# EAGLE design ponte_ampli_V1.6 (EAGLE 4.09)
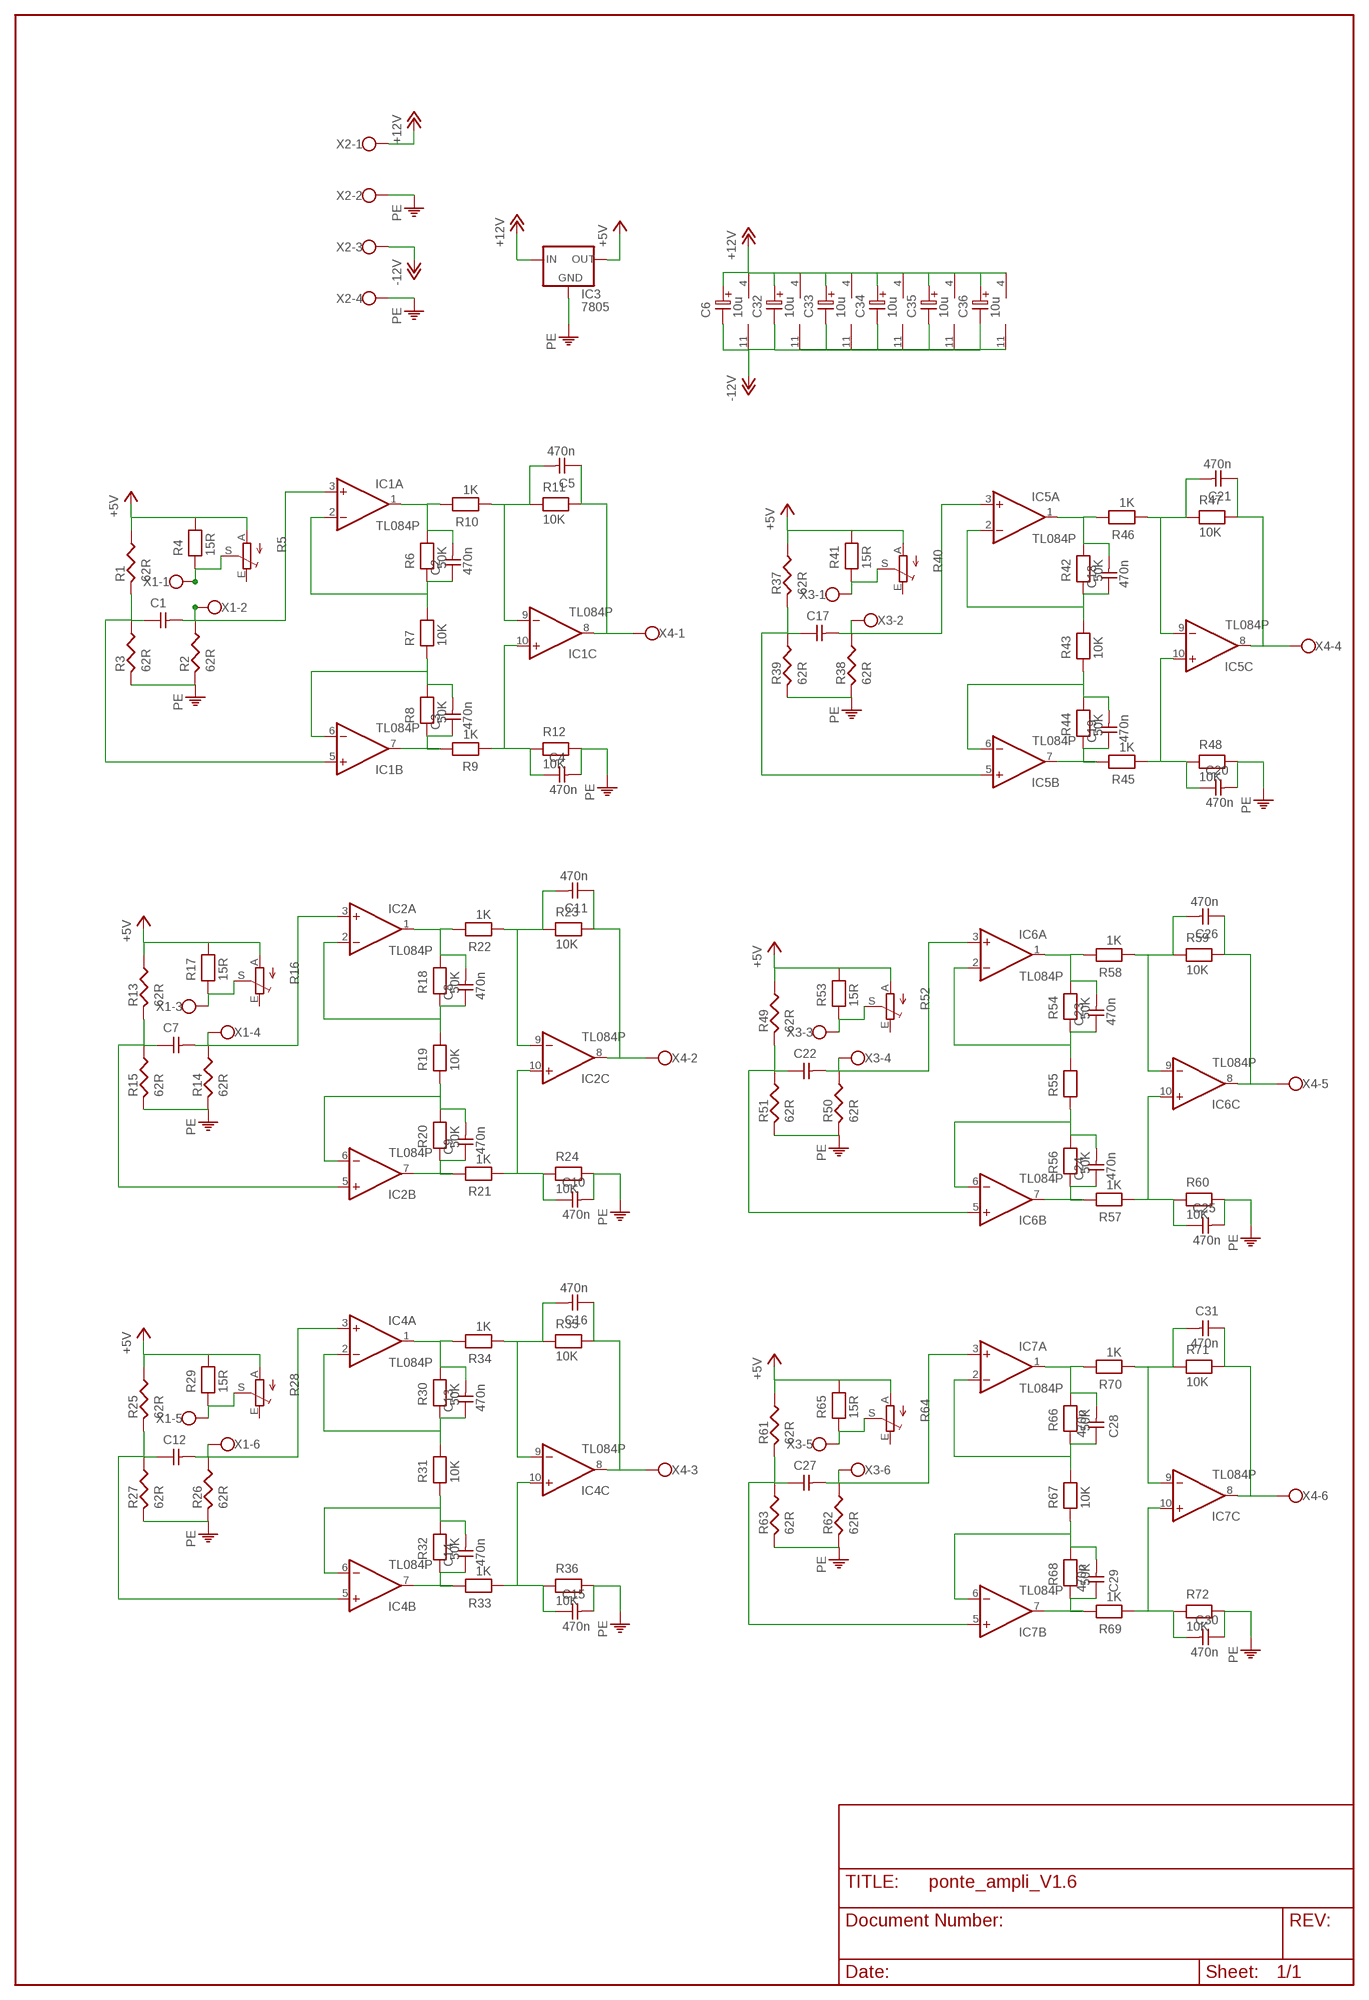
[diagram p0: schematic, sheet 1]

## Parts
C1  CAPNP-5  [C-5]
C2  470n  CAPNP-5  [C-5]
C3  470n  CAPNP-5  [C-5]
C4  470n  CAPNP-5  [C-5]
C5  470n  CAPNP-5  [C-5]
C6  10u  ELC-2,5L  [ES-2,5L]
C7  CAPNP-5  [C-5]
C8  470n  CAPNP-5  [C-5]
C9  470n  CAPNP-5  [C-5]
C10  470n  CAPNP-5  [C-5]
C11  470n  CAPNP-5  [C-5]
C12  CAPNP-5  [C-5]
C13  470n  CAPNP-5  [C-5]
C14  470n  CAPNP-5  [C-5]
C15  470n  CAPNP-5  [C-5]
C16  470n  CAPNP-5  [C-5]
C17  CAPNP-5  [C-5]
C18  470n  CAPNP-5  [C-5]
C19  470n  CAPNP-5  [C-5]
C20  470n  CAPNP-5  [C-5]
C21  470n  CAPNP-5  [C-5]
C22  CAPNP-5  [C-5]
C23  470n  CAPNP-5  [C-5]
C24  470n  CAPNP-5  [C-5]
C25  470n  CAPNP-5  [C-5]
C26  470n  CAPNP-5  [C-5]
C27  CAPNP-5  [C-5]
C28  470n  CAPNP-5  [C-5]
C29  470n  CAPNP-5  [C-5]
C30  470n  CAPNP-5  [C-5]
C31  470n  CAPNP-5  [C-5]
C32  10u  ELC-2,5L  [ES-2,5L]
C33  10u  ELC-2,5L  [ES-2,5L]
C34  10u  ELC-2,5L  [ES-2,5L]
C35  10u  ELC-2,5L  [ES-2,5L]
C36  10u  ELC-2,5L  [ES-2,5L]
IC1  TL084P  [DIL14]
IC2  TL084P  [DIL14]
IC3  7805  78XXL  [78XXL]
IC4  TL084P  [DIL14]
IC5  TL084P  [DIL14]
IC6  TL084P  [DIL14]
IC7  TL084P  [DIL14]
R1  62R  RESUS-7,5  [R-7,5]
R2  62R  RESUS-7,5  [R-7,5]
R3  62R  RESUS-7,5  [R-7,5]
R4  15R  RESEU-7,5  [R-7,5]
R5  TRIM_EU-S64W  [S64W]
R6  50K  RESEU-7,5  [R-7,5]
R7  10K  RESEU-7,5  [R-7,5]
R8  50K  RESEU-7,5  [R-7,5]
R9  1K  RESEU-7,5  [R-7,5]
R10  1K  RESEU-7,5  [R-7,5]
R11  10K  RESEU-7,5  [R-7,5]
R12  10K  RESEU-7,5  [R-7,5]
R13  62R  RESUS-7,5  [R-7,5]
R14  62R  RESUS-7,5  [R-7,5]
R15  62R  RESUS-7,5  [R-7,5]
R16  TRIM_EU-S64W  [S64W]
R17  15R  RESEU-7,5  [R-7,5]
R18  50K  RESEU-7,5  [R-7,5]
R19  10K  RESEU-7,5  [R-7,5]
R20  50K  RESEU-7,5  [R-7,5]
R21  1K  RESEU-7,5  [R-7,5]
R22  1K  RESEU-7,5  [R-7,5]
R23  10K  RESEU-7,5  [R-7,5]
R24  10K  RESEU-7,5  [R-7,5]
R25  62R  RESUS-7,5  [R-7,5]
R26  62R  RESUS-7,5  [R-7,5]
R27  62R  RESUS-7,5  [R-7,5]
R28  TRIM_EU-S64W  [S64W]
R29  15R  RESEU-7,5  [R-7,5]
R30  50K  RESEU-7,5  [R-7,5]
R31  10K  RESEU-7,5  [R-7,5]
R32  50K  RESEU-7,5  [R-7,5]
R33  1K  RESEU-7,5  [R-7,5]
R34  1K  RESEU-7,5  [R-7,5]
R35  10K  RESEU-7,5  [R-7,5]
R36  10K  RESEU-7,5  [R-7,5]
R37  62R  RESUS-7,5  [R-7,5]
R38  62R  RESUS-7,5  [R-7,5]
R39  62R  RESUS-7,5  [R-7,5]
R40  TRIM_EU-S64W  [S64W]
R41  15R  RESEU-7,5  [R-7,5]
R42  50K  RESEU-7,5  [R-7,5]
R43  10K  RESEU-7,5  [R-7,5]
R44  50K  RESEU-7,5  [R-7,5]
R45  1K  RESEU-7,5  [R-7,5]
R46  1K  RESEU-7,5  [R-7,5]
R47  10K  RESEU-7,5  [R-7,5]
R48  10K  RESEU-7,5  [R-7,5]
R49  62R  RESUS-7,5  [R-7,5]
R50  62R  RESUS-7,5  [R-7,5]
R51  62R  RESUS-7,5  [R-7,5]
R52  TRIM_EU-S64W  [S64W]
R53  15R  RESEU-7,5  [R-7,5]
R54  50K  RESEU-7,5  [R-7,5]
R55  RESEU-7,5  [R-7,5]
R56  50K  RESEU-7,5  [R-7,5]
R57  1K  RESEU-7,5  [R-7,5]
R58  1K  RESEU-7,5  [R-7,5]
R59  10K  RESEU-7,5  [R-7,5]
R60  10K  RESEU-7,5  [R-7,5]
R61  62R  RESUS-7,5  [R-7,5]
R62  62R  RESUS-7,5  [R-7,5]
R63  62R  RESUS-7,5  [R-7,5]
R64  TRIM_EU-S64W  [S64W]
R65  15R  RESEU-7,5  [R-7,5]
R66  50K  RESEU-7,5  [R-7,5]
R67  10K  RESEU-7,5  [R-7,5]
R68  50K  RESEU-7,5  [R-7,5]
R69  1K  RESEU-7,5  [R-7,5]
R70  1K  RESEU-7,5  [R-7,5]
R71  10K  RESEU-7,5  [R-7,5]
R72  10K  RESEU-7,5  [R-7,5]
X1  AK500/6  [AK500/6]
X2  AK500/4  [AK500/4]
X3  AK500/6  [AK500/6]
X4  AK500/6  [AK500/6]

## Nets
+5V: IC3.OUT R1.1 R4.2 R5.A R13.1 R16.A R17.2 R25.1 R28.A R29.2 R37.1 R40.A R41.2 R49.1 R52.A R53.2 R61.1 R64.A R65.2
+12V: C6.1 C32.1 C33.1 C34.1 C35.1 C36.1 IC1.4(P:V+) IC2.4(P:V+) IC3.IN IC4.4(P:V+) IC5.4(P:V+) IC6.4(P:V+) IC7.4(P:V+) X2.1
-12V: C6.2 C32.2 C33.2 C34.2 C35.2 C36.2 IC1.11(P:V-) IC2.11(P:V-) IC4.11(P:V-) IC5.11(P:V-) IC6.11(P:V-) IC7.11(P:V-) X2.3
N$1: C1.1 IC1.5(B:+IN) R1.2 R3.1
N$2: C1.2 IC1.3(A:+IN) R2.1 X1.2
N$3: C5.2 IC1.9(C:-IN) R10.1 R11.1
N$4: C2.2 IC1.1(A:OUT) R6.2 R10.2
N$5: R4.1 R5.S X1.1
N$6: C4.1 IC1.10(C:+IN) R9.1 R12.1
N$7: C2.1 IC1.2(A:-IN) R6.1 R7.2
N$8: C11.1 IC2.8(C:OUT) R23.2 X4.2
N$9: C3.1 IC1.7(B:OUT) R8.1 R9.2
N$10: C7.1 IC2.5(B:+IN) R13.2 R15.1
N$11: C7.2 IC2.3(A:+IN) R14.1 X1.4
N$12: R16.S R17.1 X1.3
N$13: C8.2 IC2.1(A:OUT) R18.2 R22.2
N$14: C8.1 IC2.2(A:-IN) R18.1 R19.2
N$15: C3.2 IC1.6(B:-IN) R7.1 R8.2
N$16: C9.1 IC2.7(B:OUT) R20.1 R21.2
N$17: C11.2 IC2.9(C:-IN) R22.1 R23.1
N$18: C10.1 IC2.10(C:+IN) R21.1 R24.1
N$19: C9.2 IC2.6(B:-IN) R19.1 R20.2
N$20: C12.1 IC4.5(B:+IN) R25.2 R27.1
N$21: C12.2 IC4.3(A:+IN) R26.1 X1.6
N$22: R28.S R29.1 X1.5
N$23: C13.2 IC4.1(A:OUT) R30.2 R34.2
N$24: C13.1 IC4.2(A:-IN) R30.1 R31.2
N$25: C14.1 IC4.7(B:OUT) R32.1 R33.2
N$26: C16.2 IC4.9(C:-IN) R34.1 R35.1
N$27: C15.1 IC4.10(C:+IN) R33.1 R36.1
N$28: C14.2 IC4.6(B:-IN) R31.1 R32.2
N$29: C17.1 IC5.5(B:+IN) R37.2 R39.1
N$30: C17.2 IC5.3(A:+IN) R38.1 X3.2
N$31: R40.S R41.1 X3.1
N$32: C18.2 IC5.1(A:OUT) R42.2 R46.2
N$33: C18.1 IC5.2(A:-IN) R42.1 R43.2
N$34: C19.1 IC5.7(B:OUT) R44.1 R45.2
N$35: C21.2 IC5.9(C:-IN) R46.1 R47.1
N$36: C20.1 IC5.10(C:+IN) R45.1 R48.1
N$37: C19.2 IC5.6(B:-IN) R43.1 R44.2
N$38: C22.1 IC6.5(B:+IN) R49.2 R51.1
N$39: C22.2 IC6.3(A:+IN) R50.1 X3.4
N$40: R52.S R53.1 X3.3
N$41: C23.2 IC6.1(A:OUT) R54.2 R58.2
N$42: C23.1 IC6.2(A:-IN) R54.1 R55.2
N$43: C24.1 IC6.7(B:OUT) R56.1 R57.2
N$44: C26.2 IC6.9(C:-IN) R58.1 R59.1
N$45: C25.1 IC6.10(C:+IN) R57.1 R60.1
N$46: C24.2 IC6.6(B:-IN) R55.1 R56.2
N$47: C27.1 IC7.5(B:+IN) R61.2 R63.1
N$48: C27.2 IC7.3(A:+IN) R62.1 X3.6
N$49: R64.S R65.1 X3.5
N$50: C28.2 IC7.1(A:OUT) R66.2 R70.2
N$51: C28.1 IC7.2(A:-IN) R66.1 R67.2
N$52: C29.1 IC7.7(B:OUT) R68.1 R69.2
N$53: C31.2 IC7.9(C:-IN) R70.1 R71.1
N$54: C30.2 IC7.10(C:+IN) R69.1 R72.1
N$55: C29.2 IC7.6(B:-IN) R67.1 R68.2
N$56: C16.1 IC4.8(C:OUT) R35.2 X4.3
N$57: C5.1 IC1.8(C:OUT) R11.2 X4.1
N$58: C31.1 IC7.8(C:OUT) R71.2 X4.6
N$59: C26.1 IC6.8(C:OUT) R59.2 X4.5
N$60: C21.1 IC5.8(C:OUT) R47.2 X4.4
PE: C4.2 C10.2 C15.2 C20.2 C25.2 C30.1 IC3.GND R2.2 R3.2 R12.2 R14.2 R15.2 R24.2 R26.2 R27.2 R36.2 R38.2 R39.2 R48.2 R50.2 R51.2 R60.2 R62.2 R63.2 R72.2 X2.2 X2.4
Unconnected: IC1.12(D:+IN) IC1.13(D:-IN) IC1.14(D:OUT) IC2.12(D:+IN) IC2.13(D:-IN) IC2.14(D:OUT) IC4.12(D:+IN) IC4.13(D:-IN) IC4.14(D:OUT) IC5.12(D:+IN) IC5.13(D:-IN) IC5.14(D:OUT) IC6.12(D:+IN) IC6.13(D:-IN) IC6.14(D:OUT) IC7.12(D:+IN) IC7.13(D:-IN) IC7.14(D:OUT) R5.E R16.E R28.E R40.E R52.E R64.E

## Library data of the parts
C1-C5 C7-C31 = discrete:CAPNP-5
C6 C32-C36 = discrete:ELC-2,5L
IC1 IC2 IC4-IC7 = linear:TL084: OP AMP
IC3 = v-reg:78XXL: VOLTAGE REGULATOR
R1-R3 R13-R15 R25-R27 R37-R39 R49-R51 R61-R63 = discrete:RESUS-7,5
R4 R6-R12 R17-R24 R29-R36 R41-R48 R53-R60 R65-R72 = discrete:RESEU-7,5
R5 R16 R28 R40 R52 R64 = pot:TRIM_EU-: POTENTIOMETER
X1 X3 X4 = con-ptr500:AK500/6: CONNECTOR
X2 = con-ptr500:AK500/4: CONNECTOR

## Board
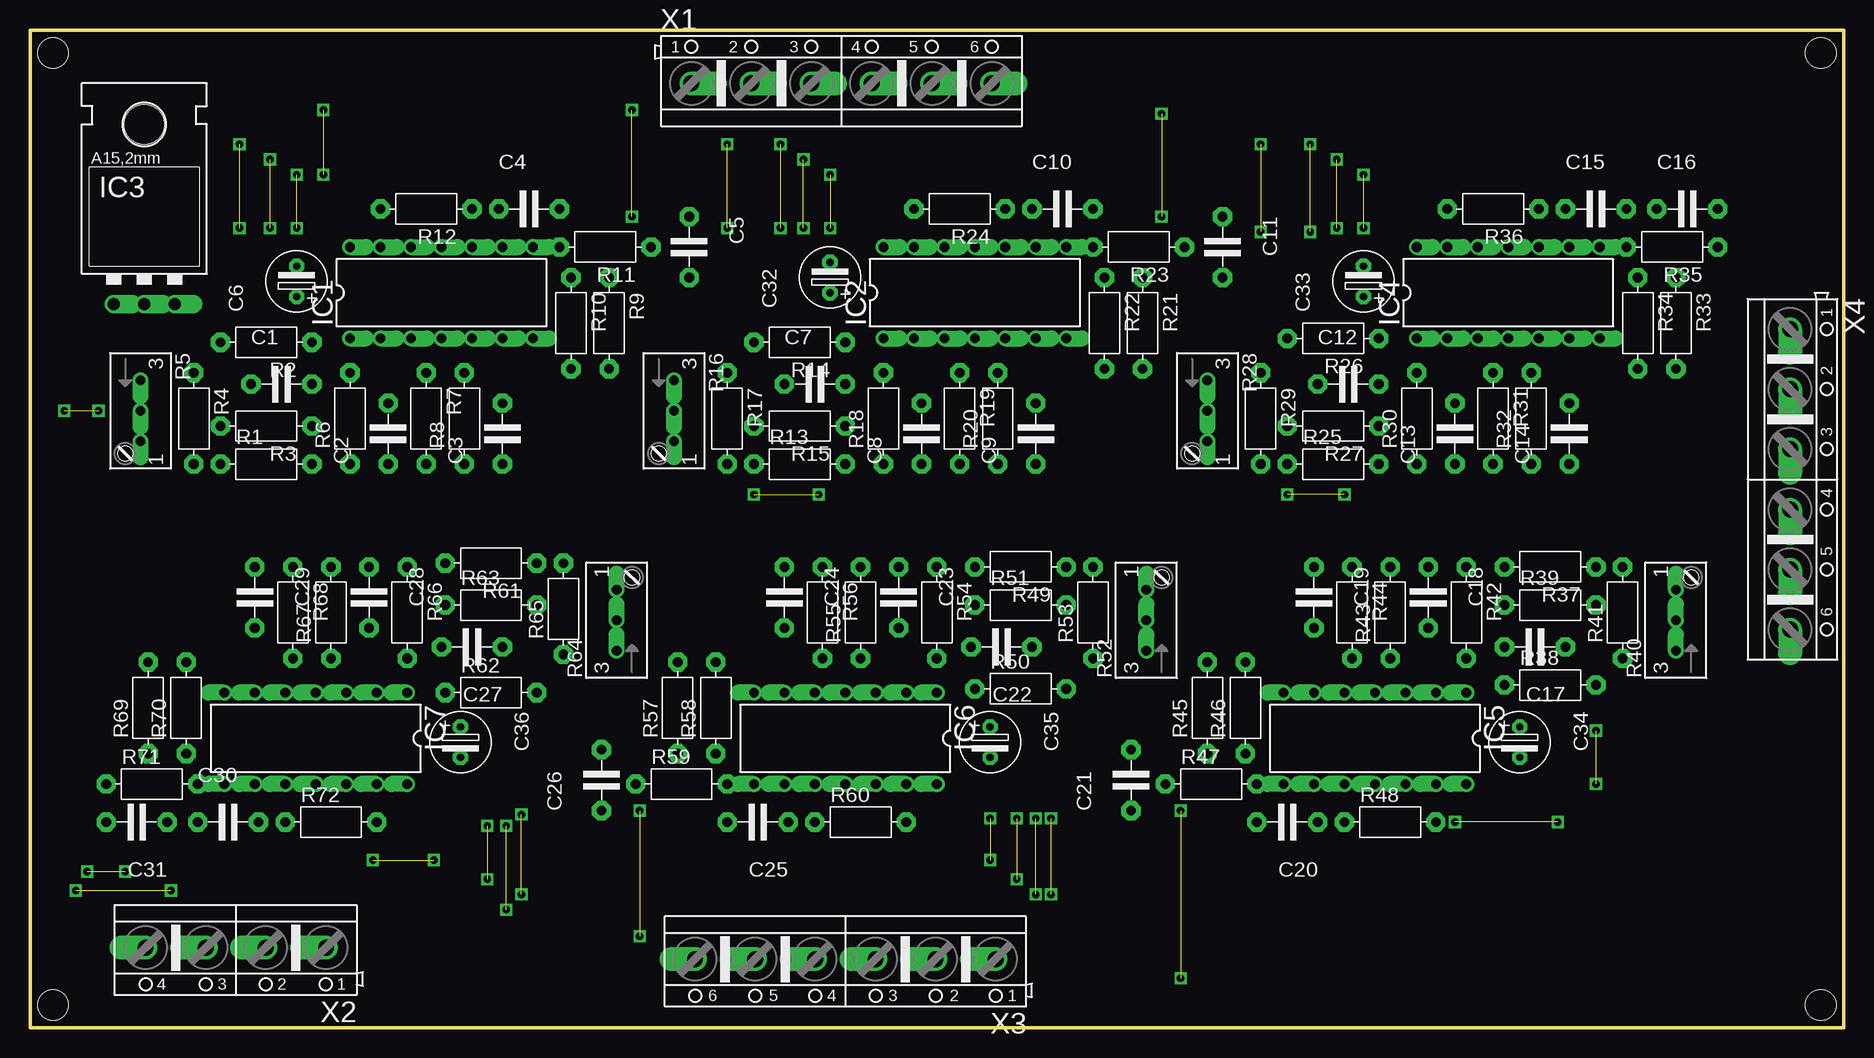
[diagram p1: board, top side]
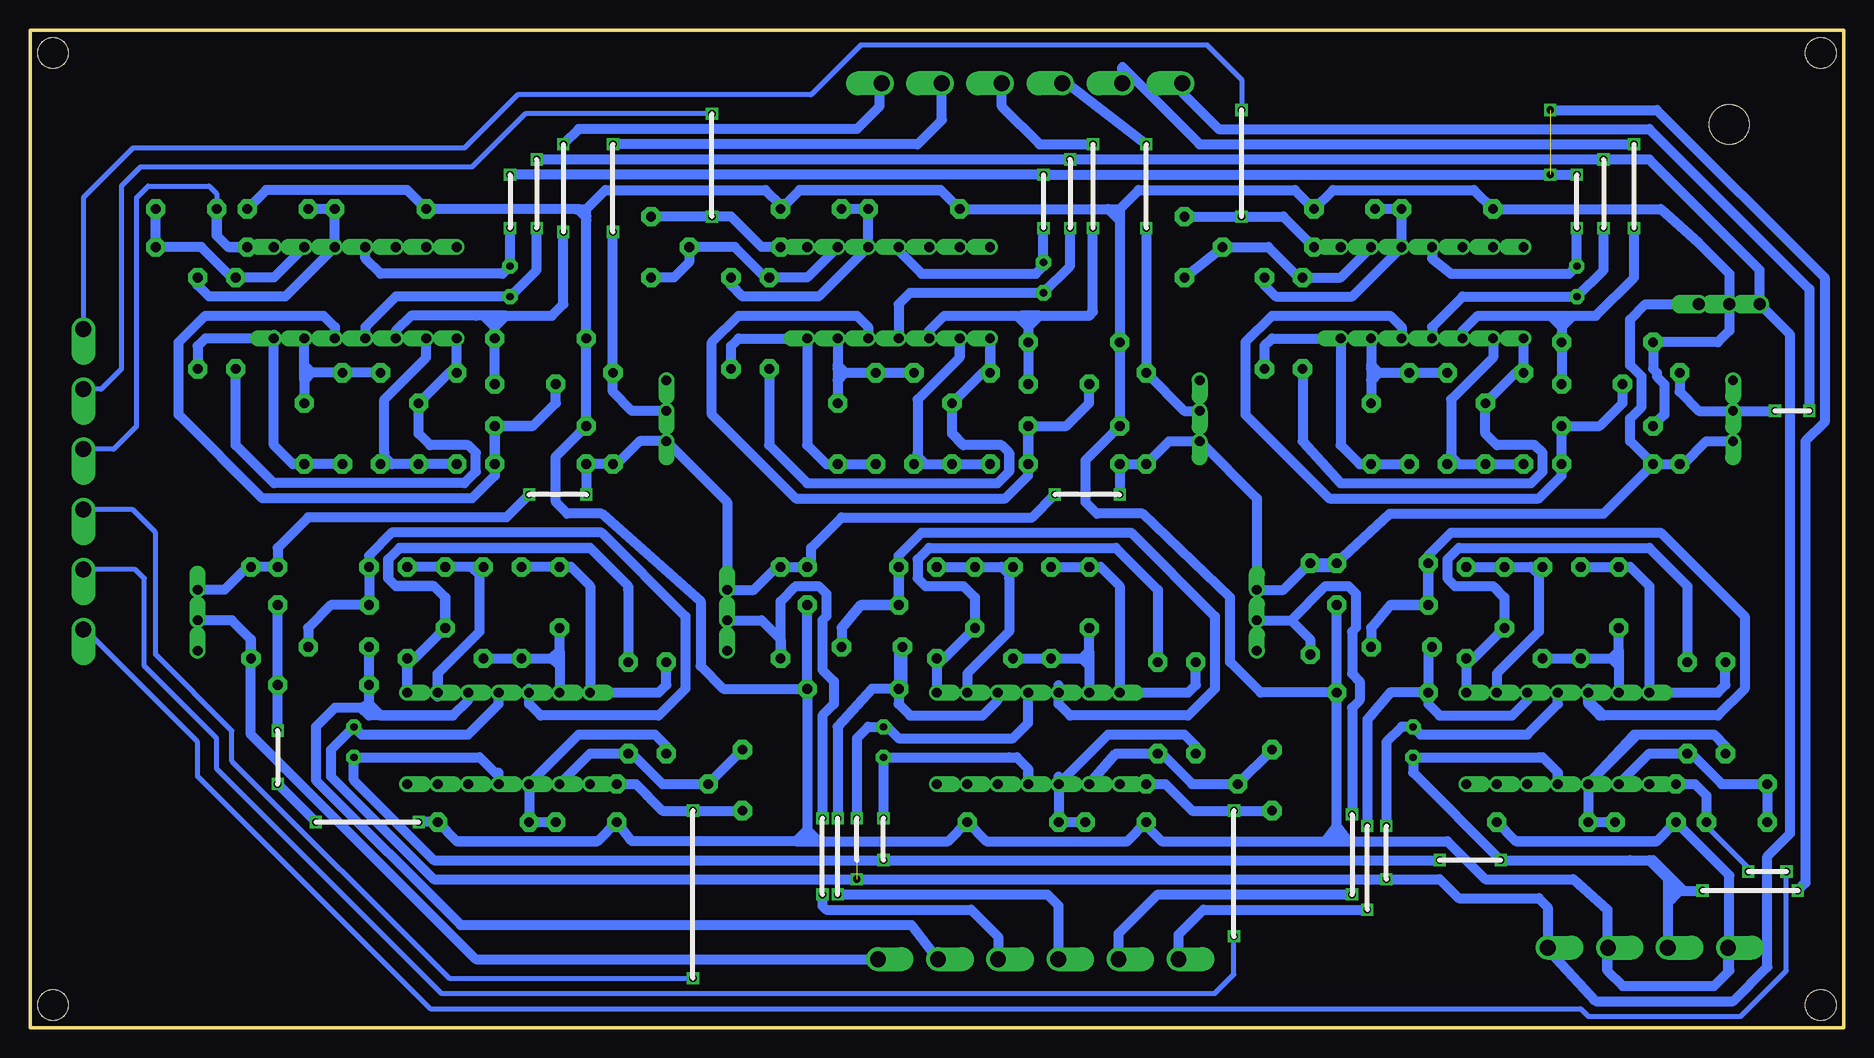
[diagram p2: board, bottom side, seen from below]

Size 151.13 x 83.19 mm. Coordinates in mm from the lower left corner, seen from the top.
Outline: 151.13,30.8 151.13,0 0,0 0,83.19 151.13,83.19 151.13,30.8
Outline: 151.13,30.8 151.13,33.34
Copper layers used: Bottom
Holes 2.54 mm at 1.9,81.28 149.22,81.28 149.22,1.91 1.9,1.91

### Footprints (pad centres in the part's own frame; a part is rotated, then mirrored left to right if it is on the bottom)
C-5 = drill 0.813 pad 1.6 octagon: 1 -2.54,0; 2 2.54,0
ES-2,5L = drill 0.61 pad 1.27 octagon: 1 0,0; 2 2.54,0
DIL14 = drill 0.813 offset: 1 -7.62,-3.81; 2 -5.08,-3.81; 3 -2.54,-3.81; 4 0,-3.81; 5 2.54,-3.81; 6 5.08,-3.81; 7 7.62,-3.81; 8 7.62,3.81; 9 5.08,3.81; 10 2.54,3.81; 11 0,3.81; 12 -2.54,3.81; 13 -5.08,3.81; 14 -7.62,3.81
78XXL = drill 1.016 offset: GND 0,-3.81; IN -2.54,-3.81; OUT 2.54,-3.81 | hole 3.302: 0,11.176
R-7,5 = drill 0.813 pad 1.6 octagon: 1 -3.81,0; 2 3.81,0
S64W = drill 0.813 offset: A 2.54,1.27; E -2.54,1.27; S 0,1.27
AK500/6 = drill 1.321 offset: 1 -12.522,0; 2 -7.518,0; 3 -2.515,0; 4 2.515,0; 5 7.518,0; 6 12.522,0
AK500/4 = drill 1.321 offset: 1 -7.518,0; 2 -2.489,0; 3 2.489,0; 4 7.518,0

### Placement (x,y rotation side)
C1  20.95,53.66 0 top
C2  29.84,49.53 90 top
C3  39.37,49.53 90 top
C4  41.59,68.26 0 top
C5  54.93,65.09 270 top
C6  22.22,60.96 90 top
C7  65.41,53.66 0 top
C8  74.3,49.53 90 top
C9  83.82,49.53 90 top
C10  86.04,68.26 0 top
C11  99.38,65.09 270 top
C12  109.85,53.66 0 top
C13  118.75,49.53 90 top
C14  128.27,49.53 90 top
C15  130.49,68.26 0 top
C16  138.11,68.26 0 top
C17  125.41,31.75 180 top
C18  116.52,35.88 270 top
C19  107,35.88 270 top
C20  104.78,17.14 180 top
C21  91.76,20.64 90 top
C22  80.96,31.75 180 top
C23  72.39,35.88 270 top
C24  62.86,35.88 270 top
C25  60.64,17.14 180 top
C26  47.62,20.64 90 top
C27  36.83,31.75 180 top
C28  28.26,35.88 270 top
C29  18.73,35.88 270 top
C30  16.51,17.14 0 top
C31  8.89,17.14 180 top
C32  66.67,61.28 90 top
C33  111.12,60.96 90 top
C34  124.14,25.08 270 top
C35  80.01,25.08 270 top
C36  35.88,25.08 270 top
IC1  34.29,61.28 0 top
IC2  78.74,61.28 0 top
IC3  9.52,64.13 0 top
IC4  123.19,61.28 0 top
IC5  112.08,24.13 180 top
IC6  67.94,24.13 180 top
IC7  23.81,24.13 180 top
R1  19.68,46.99 0 top
R2  19.68,57.15 180 top
R3  19.68,50.16 180 top
R4  13.65,50.8 270 top
R5  7.94,51.43 270 top
R6  26.67,50.8 90 top
R7  33.02,50.8 270 top
R8  36.19,50.8 90 top
R9  48.26,58.74 270 top
R10  45.08,58.74 270 top
R11  47.94,65.09 180 top
R12  33.02,68.26 180 top
R13  64.13,46.99 0 top
R14  64.13,57.15 180 top
R15  64.13,50.16 180 top
R16  52.39,51.43 270 top
R17  58.1,50.8 270 top
R18  71.12,50.8 90 top
R19  77.47,50.8 270 top
R20  80.64,50.8 90 top
R21  92.71,58.74 270 top
R22  89.53,58.74 270 top
R23  92.39,65.09 180 top
R24  77.47,68.26 180 top
R25  108.58,46.99 0 top
R26  108.58,57.47 180 top
R27  108.58,50.16 180 top
R28  96.84,51.43 270 top
R29  102.55,50.8 270 top
R30  115.57,50.8 90 top
R31  121.92,50.8 270 top
R32  125.09,50.8 90 top
R33  137.16,58.74 270 top
R34  133.99,58.74 270 top
R35  136.84,65.09 180 top
R36  121.92,68.26 180 top
R37  126.68,38.42 180 top
R38  126.68,28.57 0 top
R39  126.68,35.24 0 top
R40  138.43,33.97 90 top
R41  132.72,34.61 90 top
R42  119.7,34.61 270 top
R43  113.35,34.61 90 top
R44  110.17,34.61 270 top
R45  98.11,26.67 90 top
R46  101.28,26.67 90 top
R47  98.42,20.32 0 top
R48  113.35,17.14 0 top
R49  82.55,38.42 180 top
R50  82.55,28.26 0 top
R51  82.55,35.24 0 top
R52  94.3,33.97 90 top
R53  88.58,34.61 90 top
R54  75.56,34.61 270 top
R55  69.22,34.61 90 top
R56  66.04,34.61 270 top
R57  53.97,26.67 90 top
R58  57.15,26.67 90 top
R59  54.29,20.32 0 top
R60  69.22,17.14 0 top
R61  38.42,38.73 180 top
R62  38.42,27.94 0 top
R63  38.42,35.24 0 top
R64  50.16,33.97 90 top
R65  44.45,34.92 90 top
R66  31.43,34.61 270 top
R67  25.08,34.61 90 top
R68  21.91,34.61 270 top
R69  9.84,26.67 90 top
R70  13.02,26.67 90 top
R71  10.16,20.32 0 top
R72  25.08,17.14 0 top
X1  67.63,78.74 0 top
X2  17.14,6.67 180 top
X3  67.94,5.71 180 top
X4  146.69,45.72 270 top

### Tracks (layer width: path | path; a pad name or v marks a point on that pad's centre or on a via)
+5V  (via drill 0.61)  (2 unrouted)
  Bottom 0.406: 102.24,46.99 R29.2
  Bottom 0.813: R1.1 R4.2 13.33,46.99 11.43,48.89 R5.A | 102.24,46.99 100.33,48.89 R28.A 93.03,43.81 R52.A 90.8,36.51 88.9,38.42 R53.2 R49.1 86.04,38.42 86.04,40 83.5,42.54 67.63,42.54 v65.72,44.45 | R29.2 R25.1 v104.78,44.45 | R40.A 134.94,36.51 133.03,38.42 R41.2 R37.1 130.49,40 127.95,42.54 111.44,42.54 v109.54,44.45 | IC3.OUT 16.51,60.32 17.78,59.05 17.78,55.24 16.83,54.29 16.83,51.75 17.78,50.8 17.78,48.89 R1.1 | R1.1 20,42.86 37.78,42.86 R61.1 R65.2 46.67,36.51 R64.A 48.89,44.13 R16.A 56.2,48.89 R17.2 R13.1 v60.33,44.45
+5V1
  Bottom 0.813: 53.66,48.89 56.2,48.89 58.1,46.99 60.33,46.99
+5V2
  Bottom 0.813: 104.78,46.99 102.24,46.99 100.33,48.89 98.11,48.89
+5V3
  Bottom 0.813: 130.49,38.42 133.03,38.42 134.94,36.51 137.16,36.51
+5V4
  Bottom 0.813: 86.36,38.42 88.9,38.42 90.8,36.51 93.03,36.51
+5V5
  Bottom 0.813: 42.23,38.42 44.77,38.42 46.67,36.51 48.89,36.51
+12V  (via drill 0.61)  (5 unrouted)
  Bottom 0.406: 81.28,25.08 79.69,25.08
  Bottom 0.813: IC1.4 34.29,58.42 31.75,60.96 C6.1 20,63.18 20,66.67 | IC2.4 78.74,60.32 77.79,61.28 C32.1 64.45,63.5 64.45,66.67 | IC4.4 123.19,58.42 120.65,60.96 C33.1 108.9,63.18 v108.9,66.67 | v108.9,72.39 v64.45,72.39 v20,72.39 16.19,72.39 6.99,63.18 IC3.IN 4.44,57.78 4.44,16.19 6.35,14.29 6.35,5.08 9.21,2.22 20.64,2.22 24.45,6.35 X2.1 24.66,10.06 25.4,10.8 32.07,10.8 33.65,12.38 v38.1,12.38 v82.23,12.38 117.47,12.38 126.05,20.95 126.05,23.18 C34.1 123.51,24.45 114.62,24.45 112.08,26.99 IC5.4 | IC7.4 23.81,26.99 26.35,24.45 35.24,24.45 C36.1 36.83,25.08 38.1,23.81 v38.1,16.83 | 79.69,25.08 C35.1 80.33,25.08 | 79.69,25.08 78.74,24.13 69.22,24.13 67.95,25.4 IC6.4 | v82.23,17.46 82.23,24.13 81.28,25.08 80.33,25.08 | 80.33,25.08 79.69,25.08
+12V2
  Bottom 0.813: 123.19,57.47 123.19,58.42 120.65,60.96 111.76,60.96
+12V3
  Bottom 0.813: 112.08,27.94 112.08,26.99 114.62,24.45 123.51,24.45 124.14,25.08
-12V  (via drill 0.61)  (7 unrouted)
  Bottom 0.813: IC1.11 34.29,64.13 32.7,62.86 22.86,62.86 C6.2 v22.22,66.67 | IC2.11 78.74,64.77 76.84,62.86 67.31,62.86 66.68,63.5 C32.2 v66.68,66.67 | IC4.11 123.19,64.13 121.92,62.86 111.76,62.86 C33.2 111.13,66.67 | IC7.11 23.81,21.27 25.08,22.54 C36.2 35.88,21.27 v28.57,13.97 17.78,13.97 | IC5.11 112.08,20.95 113.67,22.54 C34.2 124.14,20.64 117.47,13.97 v80.01,13.97 v33.65,13.97 | IC6.11 67.95,21.59 68.9,22.54 C35.2 v80.01,17.46 | 14.66,12.43 X2.3 | 16.19,13.97 14.66,12.43 | v111.13,71.12 v66.68,71.12 v24.45,71.12 v22.22,71.12 | v3.81,11.43 3.18,12.06 3.18,48.89 1.59,50.48 1.59,62.55 15.56,76.52 v24.45,76.52 | 14.66,12.43 14.61,12.43 14.61,12.38 | 14.61,12.38 14.61,11.11 13.97,11.75 14.61,12.38 | 16.19,13.97 14.61,12.38 | 17.78,13.97 16.19,13.97 | 17.78,13.97 15.88,13.97 13.65,11.75 | 13.65,11.75 13.97,11.43 | 14.61,10.8 14.29,10.8 | 14.29,10.8 13.65,11.43 | 14.29,10.8 14.61,10.48 14.61,10.8 | 13.97,11.43 14.61,10.8 | 13.97,11.43 13.33,11.43 | 13.33,11.43 v11.75,11.43 | 13.65,11.75 13.33,11.43
-12V2  (via drill 0.61)
  other vias: 111.12,66.67
-12V3
  Bottom 0.813: 124.14,22.54 113.67,22.54
-12V4
  Bottom 0.813: 80.01,22.54 69.53,22.54
-12V5
  Bottom 0.813: 35.88,22.54 25.4,22.54
N$1
  Bottom 0.813: IC1.5 36.83,58.42 37.78,59.37 47.62,59.37 49.85,57.15 49.85,51.12 42.86,44.13 25.4,44.13 23.5,46.04 R1.2 R3.1 20.32,50.16 18.42,52.07 C1.1
N$2  (via drill 0.61)  (1 unrouted)
  Bottom 0.813: C1.2 R2.1 23.5,58.42 | IC1.3 31.75,58.1 30.48,59.37 | 30.48,59.37 24.45,59.37 23.5,58.42 | 30.48,59.37 22.54,59.37 | 22.54,59.37 22.22,59.37 | 22.54,59.37 23.5,58.42 | 22.54,59.37 20.64,59.37 17.46,62.55 v17.46,66.67 | X1.2 60.11,80.11 53.66,73.66 v17.46,73.66
N$3
  Bottom 0.813: C5.2 R11.1 47.94,65.09 45.4,62.55 R10.1 41.91,62.55 IC1.9
N$4
  Bottom 0.813: R6.2 26.67,54.29 | R6.2 IC1.1 | R6.2 27.31,54.61 C2.2 29.85,49.53 28.89,48.58 25.72,48.58 25.08,47.94 25.08,46.35 26.03,45.4 41.91,45.4 45.09,48.89 R10.2
N$5  (via drill 0.61)  (1 unrouted)
  Bottom 0.813: 12.07,51.43 R5.S | R4.1 13.65,53.02 12.07,51.43 | 12.07,51.43 v5.71,51.43 | v2.86,51.43 2.86,61.59 16.19,74.93 52.07,74.93 55.11,77.96 X1.1
N$6
  Bottom 0.813: C4.1 R12.1 IC1.10 40.96,60.96 47.31,60.96 48.26,61.91 R9.1
N$7
  Bottom 0.813: R6.1 C2.1 32.07,46.99 | IC1.2 29.21,55.88 32.7,52.39 32.7,47.94 | 32.7,47.94 32.7,47.31 R7.2 32.07,46.99 | 32.7,47.94 32.7,47.62 32.07,46.99
N$8  (via drill 0.61)  (1 unrouted)
  Bottom 0.406: v94.3,76.2 109.86,76.2 114.3,71.75 141.92,71.75 143.51,70.17 143.51,54.93 145.2,53.24 X4.2
  Bottom 0.813: R23.2 IC2.8 R23.2 | R23.2 90.17,65.09 92.71,67.63 v94.3,67.63 C11.1
N$9
  Bottom 0.813: R8.1 C3.1 40.32,46.99 41.91,48.58 IC1.7 47.62,57.47 48.26,56.83 R9.2
N$10
  Bottom 0.813: R15.1 R13.2 | R15.1 64.77,50.16 62.87,52.07 C7.1 | R15.1 67.95,46.04 69.85,44.13 87.31,44.13 94.3,51.12 94.3,57.15 92.07,59.37 82.23,59.37 81.28,58.42 IC2.5
N$11  (via drill 0.61)  (1 unrouted)
  Bottom 0.813: C7.2 R14.1 67.95,58.42 | 67.95,58.42 68.9,59.37 74.93,59.37 76.2,58.1 IC2.3 | 67.95,58.42 67.95,59.05 67.63,59.37 | 67.63,59.37 68.58,59.37 | 66.99,59.37 67.63,59.37 | 67.95,58.42 66.99,59.37 | 66.99,59.37 62.87,59.37 62.55,59.69 v62.55,66.67 | X1.4 70.14,76.81 66.99,73.66 v62.55,73.66
N$12  (via drill 0.61)  (1 unrouted)
  Bottom 0.813: R16.S 54.93,51.43 R17.1 v58.1,66.67 | X1.3 65.09,79.06 v58.1,73.66
N$13
  Bottom 0.813: IC2.1 R18.2 71.75,54.61 C8.2 74.29,49.53 73.34,48.58 70.17,48.58 69.53,47.94 69.53,46.35 70.49,45.4 86.36,45.4 89.53,48.58 R22.2
N$14
  Bottom 0.813: R18.1 C8.1 76.52,46.99 | 76.52,46.99 77.15,47.62 77.15,52.39 73.66,55.88 IC2.2 | 76.52,46.99 R19.2
N$15
  Bottom 0.813: R7.1 R8.2 38.73,54.61 | IC1.6 39.37,55.24 | 39.37,53.97 C3.2 | 39.37,53.97 38.73,54.61 | 39.37,55.24 39.37,53.97 | 39.37,55.24 39.37,54.93 39.05,54.61 39.05,54.93 39.37,55.24 | 39.37,55.24 38.73,54.61
N$16
  Bottom 0.813: C9.1 R20.1 C9.1 | C9.1 84.77,46.99 86.36,48.58 IC2.7 92.07,57.47 92.71,56.83 R21.2
N$17
  Bottom 0.813: IC2.9 86.36,62.55 R22.1 89.85,62.55 92.39,65.09 R23.1 96.2,63.82 97.47,62.55 C11.2
N$18
  Bottom 0.813: R21.1 92.71,61.91 91.76,60.96 85.41,60.96 IC2.10 R24.1 | R24.1 C10.1 R24.1
N$19
  Bottom 0.813: R19.1 R20.2 83.18,54.61 83.82,55.24 | IC2.6 83.82,55.24 | 83.82,55.24 C9.2
N$20
  Bottom 0.813: C12.1 107.32,52.07 109.22,50.16 R27.1 | R25.2 R27.1 | R27.1 112.39,46.04 114.3,44.13 131.76,44.13 138.75,51.12 138.75,57.15 136.52,59.37 126.68,59.37 125.73,58.42 IC4.5
N$21  (via drill 0.61)  (1 unrouted)
  Bottom 0.813: R26.1 C12.2 R26.1 | 113.98,59.37 113.35,59.37 112.39,58.42 | 113.98,59.37 119.38,59.37 120.65,58.1 IC4.3 | R26.1 112.39,58.42 | 112.39,58.42 112.39,59.37 113.98,59.37 | 111.44,59.37 113.98,59.37 | 111.44,59.37 110.81,59.37 | 112.39,58.42 111.44,59.37 | 111.44,59.37 107.63,59.37 106.68,60.32 v106.68,66.36 | v106.68,73.66 105.41,74.93 82.23,74.93 80.33,76.83 80.33,78.42 80.01,78.74 X1.6
N$22  (via drill 0.61)  (1 unrouted)
  Bottom 0.813: 102.55,53.02 R29.1 | R28.S 100.96,51.43 102.55,53.02 | 102.55,53.02 102.55,54.29 102.24,54.61 R29.1 | R29.1 v102.55,66.36 | X1.5 75.15,75.67 77.15,73.66 v102.55,73.66
N$23
  Bottom 0.813: IC4.1 R30.2 116.21,54.61 C13.2 118.75,49.53 117.79,48.58 114.62,48.58 113.98,47.94 113.98,46.35 114.93,45.4 130.81,45.4 133.99,48.58 R34.2
N$24
  Bottom 0.813: R30.1 C13.1 120.97,46.99 121.6,47.62 | 121.6,47.62 121.6,52.39 118.11,55.88 IC4.2 | 121.6,47.62 121.6,47.31 R31.2
N$25
  Bottom 0.813: IC4.7 130.81,57.78 | IC4.7 130.81,48.58 129.22,46.99 C14.1 R32.1 | IC4.7 136.52,57.47 137.16,56.83 R33.2
N$26
  Bottom 0.813: C16.2 R35.1 136.84,65.09 134.3,62.55 R34.1 130.81,62.55 IC4.9
N$27
  Bottom 0.813: C15.1 R36.1 IC4.10 129.86,60.96 136.21,60.96 137.16,61.91 R33.1
N$28
  Bottom 0.813: 128.27,53.97 IC4.6 | R31.1 R32.2 127.64,54.61 128.27,53.97 | 128.27,53.97 C14.2
N$29
  Bottom 0.813: C17.1 127.95,33.34 126.05,35.24 R39.1 R37.2 122.87,39.37 120.97,41.27 103.5,41.27 96.52,34.29 96.52,28.26 98.74,26.03 108.58,26.03 109.54,26.99 IC5.5 109.54,28.26
N$30
  Bottom 0.813: C17.2 R38.1 122.87,26.99 | 121.92,26.03 115.89,26.03 114.62,27.3 IC5.3 | X3.2 77.69,8.57 115.25,8.57 127.32,20.64 127.32,25.08 125.73,26.67 123.51,26.67 | 121.92,26.03 122.87,26.03 | 121.92,26.03 122.87,26.99 | 122.87,26.99 123.51,26.67 | 122.87,26.03 123.51,26.67 | 122.87,26.03 122.56,26.35 122.87,26.67
N$31
  Bottom 0.813: R40.S 134.3,33.97 132.72,32.38 R41.1 132.72,24.45 113.98,5.71 X3.1
N$32
  Bottom 0.813: IC5.1 R42.2 119.06,30.8 C18.2 116.52,35.88 117.47,36.83 120.65,36.83 121.28,37.46 121.28,39.05 120.33,40 104.46,40 101.28,36.83 R46.2
N$33
  Bottom 0.813: C18.1 R42.1 C18.1 | 113.67,38.42 113.67,33.02 117.16,29.53 IC5.2 117.16,27.62 | 113.67,38.42 R43.2 | 113.67,38.42 C18.1
N$34
  Bottom 0.813: R44.1 C19.1 106.04,38.42 104.46,36.83 IC5.7 98.74,27.94 98.11,28.57 R45.2
N$35
  Bottom 0.813: 101.6,22.86 R46.1 | 101.6,22.86 100.96,22.86 98.43,20.32 R47.1 C21.2 | 101.6,22.86 104.46,22.86 IC5.9
N$36
  Bottom 0.813: R45.1 98.11,23.49 99.06,24.45 105.41,24.45 IC5.10 R48.1 C20.1
N$37
  Bottom 0.813: R44.2 107.32,30.8 | R44.2 R43.1 R44.2 | 107.32,30.8 107.32,30.48 107,30.16 IC5.6 | C19.2 107,31.11 107.32,30.8
N$38
  Bottom 0.813: C22.1 83.5,33.34 81.91,35.24 R51.1 R49.2 78.74,39.37 76.84,41.27 59.37,41.27 52.39,34.29 52.39,28.26 54.61,26.03 64.45,26.03 65.4,26.99 IC6.5 65.4,28.57
N$39  (via drill 0.61)  (1 unrouted)
  Bottom 0.813: IC6.3 70.49,27.3 71.75,26.03 77.79,26.03 78.74,26.99 R50.1 | R50.1 80.96,28.26 83.82,25.08 v83.82,17.46 | X3.4 65.43,10.19 66.36,11.11 v83.82,11.11 | C22.2 78.42,28.57 R50.1
N$40  (via drill 0.61)  (1 unrouted)
  Bottom 0.813: R52.S 90.17,33.97 88.58,32.38 R53.1 88.58,35.56 87.31,36.83 85.41,36.83 84.77,36.19 84.77,34.29 85.09,33.97 85.09,29.84 84.14,28.89 84.14,26.99 85.09,26.03 v85.09,17.46 | X3.3 70.46,7.59 72.71,9.84 84.77,9.84 85.09,10.16 v85.09,11.11
N$41
  Bottom 0.813: IC6.1 R54.2 74.93,30.8 C23.2 72.39,35.88 73.34,36.83 76.52,36.83 77.15,37.46 77.15,39.05 76.2,40 60.64,40 57.15,36.51 R58.2
N$42
  Bottom 0.813: IC6.2 73.03,29.53 69.53,33.02 69.53,38.42 | R54.1 C23.1 69.53,38.42 | 69.53,38.42 R55.2
N$43
  Bottom 0.813: R56.1 C24.1 61.91,38.42 60.33,36.83 IC6.7 54.61,27.94 53.97,28.57 R57.2
N$44
  Bottom 0.813: IC6.9 60.64,22.86 R58.1 56.83,22.86 54.29,20.32 R59.1 C26.2
N$45
  Bottom 0.813: R57.1 53.97,23.49 54.93,24.45 61.28,24.45 IC6.10 | IC6.10 65.4,20.95 | IC6.10 R60.1 C25.1
N$46
  Bottom 0.813: R55.1 R56.2 63.18,30.8 | 63.18,30.8 62.87,30.48 IC6.6 | 63.18,30.8 62.87,31.11 C24.2
N$47
  Bottom 0.813: R61.2 R63.1 | R63.1 37.78,35.24 39.37,33.34 C27.1 | R63.1 34.61,39.37 32.7,41.27 15.24,41.27 8.25,34.29 8.25,28.26 10.48,26.03 20,26.03 21.27,27.3 IC7.5 21.27,28.26
N$48  (via drill 0.61)  (1 unrouted)
  Bottom 0.813: IC7.3 26.35,27.3 27.62,26.03 33.65,26.03 34.61,26.99 R62.1 | R62.1 37.78,27.94 39.69,25.72 v39.69,16.83 | X3.6 55.42,7.76 53.34,9.84 v39.69,9.84 | R62.1 34.61,31.43 C27.2
N$49  (via drill 0.61)  (1 unrouted)
  Bottom 0.813: R65.1 44.45,32.38 46.04,33.97 | R64.S 46.04,33.97 | 46.04,33.97 43.18,36.83 41.27,36.83 40.64,36.19 40.64,33.34 40.96,33.02 40.96,29.53 40.32,28.89 40.32,27.3 40.96,26.67 v40.96,17.78 | X3.5 60.43,7.84 57.15,11.11 v40.96,11.11
N$50
  Bottom 0.813: IC7.1 R66.2 30.8,30.8 C28.2 28.26,35.88 29.21,36.83 32.39,36.83 33.02,37.46 33.02,39.05 32.07,40 16.19,40 13.02,36.83 R70.2
N$51
  Bottom 0.813: C28.1 R66.1 C28.1 | 26.03,38.42 25.4,37.78 25.4,33.02 28.89,29.53 IC7.2 | C28.1 26.03,38.42 | 26.03,38.42 R67.2
N$52
  Bottom 0.813: R68.1 C29.1 17.78,38.42 16.19,36.83 IC7.7 10.48,27.94 9.84,28.57 R69.2
N$53
  Bottom 0.813: IC7.9 16.19,22.86 R70.1 12.7,22.86 10.16,20.32 R71.1 C31.2
N$54
  Bottom 0.813: R69.1 9.84,23.49 10.79,24.45 17.14,24.45 IC7.10 R72.1 C30.2
N$55
  Bottom 0.813: R67.1 R68.2 19.05,30.8 | 19.05,30.8 19.05,30.48 18.73,30.16 IC7.6 | C29.2 18.73,31.11 19.05,30.8
N$56
  Bottom 0.406: X4.3 144.17,48.23 142.24,50.16 142.24,69.22 141.29,70.17 136.21,70.17 135.57,69.53 C16.1
  Bottom 0.813: R35.2 IC4.8 | C16.1 135.57,66.04 134.62,65.09 R35.2 | R35.2 IC4.8 | R35.2 IC4.8
N$57  (via drill 0.61)  (1 unrouted)
  Bottom 0.406: X4.1 146.69,67.63 146.69,69.22 142.56,73.34 114.93,73.34 110.49,77.79 86.04,77.79 81.91,81.91 53.02,81.91 50.17,79.06 v50.17,76.52
  Bottom 0.813: IC1.8 R11.2 46.67,67.63 v50.17,67.63 C5.1
N$58  (via drill 0.61)  (1 unrouted)
  Bottom 0.406: X4.6 146.55,33.2 137.16,23.81 137.16,20.95 117.79,1.59 21.91,1.59 21.27,0.95 8.57,0.95 4.76,4.76 v4.76,13.02 | IC7.8 12.38,20.32 | 11.43,19.37 11.43,16.83 7.94,13.33 v7.94,13.02
  Bottom 0.813: IC7.8 R71.2 12.38,20.32 11.43,19.37 C31.1
N$59  (via drill 0.61)  (1 unrouted)
  Bottom 0.406: X4.5 142.34,38.2 141.6,37.46 141.6,30.16 135.57,24.13 135.57,21.59 116.84,2.86 52.39,2.86 50.8,4.44 v50.8,7.62
  Bottom 0.813: R59.2 IC6.8 R59.2 | C26.1 v50.8,18.1 54.29,18.1 56.52,20.32 R59.2
N$60  (via drill 0.61)  (1 unrouted)
  Bottom 0.406: X4.4 142.58,43.2 140.65,41.27 140.65,31.11 134.3,24.76 134.3,22.22 116.21,4.13 v95.89,4.13
  Bottom 0.813: IC5.8 R47.2 100.65,20.32 98.43,18.1 v95.89,18.1 C21.1
N$61
  Bottom 0.813: 81.28,57.47 81.28,58.42 82.23,59.37 92.07,59.37 94.3,57.15 94.3,51.12 87.31,44.13 69.85,44.13 67.95,46.04 67.95,50.16
N$62
  Bottom 0.813: 76.2,57.47 76.2,58.1 74.93,59.37 68.9,59.37 67.95,58.42 67.95,53.66
N$64
  Bottom 0.813: 69.53,47.94 69.53,46.35 70.49,45.4
N$65
  Bottom 0.813: 76.52,46.99 71.12,46.99 | 76.52,46.99 77.47,46.99 77.15,47.31 77.15,47.94 | 76.52,46.99 77.15,47.62 77.15,47.94 | 77.15,52.39 77.15,47.94
N$66
  Bottom 0.813: 80.64,46.99 84.77,46.99 86.36,48.58 86.36,57.47 92.07,57.47 92.71,56.83 92.71,54.93
N$67
  Bottom 0.813: 73.66,55.88 73.66,57.47
N$68
  Bottom 0.813: 83.5,68.26 81.28,68.26 81.28,65.09 85.41,60.96 91.76,60.96 92.71,61.91 92.71,62.55
N$69
  Bottom 0.813: 83.82,57.47 83.82,55.24 | 83.82,52.07 83.82,53.97 83.18,54.61 83.82,55.24 | 83.82,55.24 83.82,54.93 83.5,54.61 83.5,54.93 83.82,55.24
N$70
  Bottom 0.813: 123.19,64.13 123.19,65.09
N$71
  Bottom 0.813: 125.73,57.47 125.73,58.42 126.68,59.37 136.52,59.37 138.75,57.15 138.75,51.12 131.76,44.13 114.3,44.13 112.39,46.04 112.39,50.16 109.22,50.16 107.32,52.07 107.32,53.66
N$72
  Bottom 0.813: 120.65,57.47 120.65,58.1 119.38,59.37 113.35,59.37 112.39,58.42 112.39,53.66
N$73
  Bottom 0.813: 102.55,54.61 102.55,53.02 100.96,51.43 98.11,51.43
N$74
  Bottom 0.813: 115.57,54.61 115.57,54.29 | 115.57,54.61 115.57,57.47 | 115.57,54.61 116.21,54.61 118.75,52.07 118.75,49.53 117.79,48.58 114.62,48.58 113.98,47.94 113.98,46.35 114.93,45.4 130.81,45.4
N$75
  Bottom 0.813: 118.11,57.47 118.11,55.88 121.6,52.39 121.6,47.94 | 121.6,47.94 121.6,47.31 121.92,46.99 120.97,46.99 | 115.57,46.99 120.97,46.99 | 121.6,47.94 121.6,47.62 120.97,46.99
N$76
  Bottom 0.813: 125.1,46.99 129.22,46.99 130.81,48.58 130.81,57.47 136.52,57.47 137.16,56.83 137.16,54.93
N$77
  Bottom 0.813: 140.65,68.26 140.65,65.09 136.84,65.09 134.3,62.55 130.81,62.55 128.27,65.09
N$78
  Bottom 0.813: 127.95,68.26 125.73,68.26 125.73,65.09 129.86,60.96 136.21,60.96 137.16,61.91 137.16,62.55
N$79
  Bottom 0.813: 128.27,55.24 128.27,57.47 | 128.27,53.97 128.27,52.07 | 121.92,54.61 127.64,54.61 | 127.64,54.61 128.27,53.97 | 128.27,53.97 128.27,55.24 | 128.27,55.24 128.27,54.93 127.95,54.61 127.95,54.93 128.27,55.24 | 127.64,54.61 128.27,55.24
N$80
  Bottom 0.813: 135.57,68.26 135.57,66.04 134.62,65.09 130.81,65.09
N$81
  Bottom 0.813: 109.54,27.94 109.54,26.99 108.58,26.03 98.74,26.03 96.52,28.26 96.52,34.29 103.5,41.27 120.97,41.27 122.87,39.37 122.87,35.24 126.05,35.24 127.95,33.34 127.95,31.75
N$82
  Bottom 0.813: 114.62,27.94 114.62,27.3 115.89,26.03 121.92,26.03 122.87,26.99 122.87,31.75
N$83
  Bottom 0.813: 132.72,30.8 132.72,32.38 134.3,33.97 137.16,33.97
N$84
  Bottom 0.813: 119.7,30.8 119.7,31.11 | 119.7,30.8 119.7,27.94 | 119.7,30.8 119.06,30.8 116.52,33.34 116.52,35.88 117.47,36.83 120.65,36.83 121.28,37.46 121.28,39.05 120.33,40 104.46,40
N$85
  Bottom 0.813: 117.16,27.94 117.16,29.53 113.67,33.02 113.67,37.46 | 113.67,37.46 113.67,38.1 113.35,38.42 114.3,38.42 | 114.3,38.42 119.7,38.42 | 113.67,37.46 113.67,37.78 114.3,38.42
N$86
  Bottom 0.813: 110.17,38.42 106.04,38.42 104.46,36.83 104.46,27.94 98.74,27.94 98.11,28.57 98.11,30.48
N$87
  Bottom 0.813: 107,20.32 104.46,22.86 100.96,22.86 98.43,20.32 94.61,20.32
N$88
  Bottom 0.813: 107.32,17.14 109.54,17.14 109.54,20.32 105.41,24.45 99.06,24.45 98.11,23.49 98.11,22.86
N$89
  Bottom 0.813: 107,30.16 107,27.94 | 107,31.43 107,33.34 | 113.35,30.8 107.63,30.8 | 107.63,30.8 107,31.43 | 107,31.43 107,30.16 | 107,30.16 107,30.48 107.32,30.8 107.32,30.48 107,30.16 | 107.63,30.8 107,30.16
N$90
  Bottom 0.813: 99.69,19.37 100.65,20.32 104.46,20.32
N$91
  Bottom 0.813: 65.4,27.94 65.4,26.99 64.45,26.03 54.61,26.03 52.39,28.26 52.39,34.29 59.37,41.27 76.84,41.27 78.74,39.37 78.74,35.24 81.91,35.24 83.5,33.34 83.5,31.75
N$92
  Bottom 0.813: 70.49,27.94 70.49,27.3 71.75,26.03 77.79,26.03 78.74,26.99 78.74,31.75
N$93
  Bottom 0.813: 88.58,30.8 88.58,32.38 90.17,33.97 93.03,33.97
N$94
  Bottom 0.813: 75.56,30.8 75.56,31.11 | 75.56,30.8 75.56,27.94 | 75.56,30.8 74.93,30.8 72.39,33.34 72.39,35.88 73.34,36.83 76.52,36.83 77.15,37.46 77.15,39.05 76.2,40
N$95
  Bottom 0.813: 73.03,27.94 73.03,29.53 69.53,33.02 69.53,37.46 | 69.53,37.46 69.53,38.1 69.22,38.42 70.17,38.42 | 75.56,38.42 70.17,38.42 | 69.53,37.46 69.53,37.78 70.17,38.42
N$96
  Bottom 0.813: 60.33,36.83 60.33,27.94 54.61,27.94 53.97,28.57 53.97,30.48
N$97
  Bottom 0.813: 60.33,22.86 56.83,22.86 54.29,20.32 50.48,20.32
N$98
  Bottom 0.813: 63.18,17.14 65.4,17.14 65.4,20.32 61.28,24.45 54.93,24.45 53.97,23.49 53.97,22.86
N$99
  Bottom 0.813: 62.87,30.16 62.87,27.94 | 62.87,31.43 62.87,33.34 | 69.22,30.8 63.5,30.8 | 63.5,30.8 62.87,31.43 | 62.87,31.43 62.87,30.16 | 62.87,30.16 62.87,30.48 63.18,30.8 63.18,30.48 62.87,30.16 | 63.5,30.8 62.87,30.16
N$100
  Bottom 0.813: 55.56,19.37 56.52,20.32 60.33,20.32
N$101
  Bottom 0.813: 21.27,27.94 21.27,26.99 20.32,26.03 10.48,26.03 8.25,28.26 8.25,34.29 15.24,41.27 32.7,41.27 34.61,39.37 34.61,35.24 37.78,35.24 39.37,33.34
N$102
  Bottom 0.813: 26.35,27.94 26.35,27.3 27.62,26.03 33.65,26.03 34.61,26.99
N$103
  Bottom 0.813: 44.45,30.8 44.45,32.38 46.04,33.97 48.89,33.97
N$104
  Bottom 0.813: 31.43,30.8 31.43,31.11 | 31.43,30.8 31.43,27.94 | 16.19,40 32.07,40 33.02,39.05 33.02,37.46 32.39,36.83 29.21,36.83 28.26,35.88 28.26,33.34 30.8,30.8 31.43,30.8
N$105
  Bottom 0.813: 28.89,27.94 28.89,29.53 25.4,33.02 25.4,37.46 | 25.4,37.46 25.4,38.1 25.08,38.42 26.03,38.42 | 31.43,38.42 26.03,38.42 | 25.4,37.46 25.4,37.78 26.03,38.42
N$106
  Bottom 0.813: 21.91,38.42 17.78,38.42 16.19,36.83 16.19,27.94 10.48,27.94 9.84,28.57 9.84,30.48
N$107
  Bottom 0.813: 6.35,17.14 6.35,20.32 10.16,20.32 12.7,22.86 16.19,22.86 18.73,20.32
N$108
  Bottom 0.813: 19.05,17.14 21.27,17.14 21.27,20.32 17.46,24.45 10.79,24.45 9.84,23.49 9.84,22.86
N$109
  Bottom 0.813: 18.73,30.16 18.73,27.94 | 18.73,31.43 18.73,33.34 | 25.08,30.8 19.37,30.8 | 19.37,30.8 18.73,31.43 | 18.73,31.43 18.73,30.16 | 18.73,30.16 18.73,30.48 19.05,30.8 19.05,30.48 18.73,30.16 | 19.37,30.8 18.73,30.16
N$110
  Bottom 0.813: 11.43,17.14 11.43,19.37 12.38,20.32 16.19,20.32
N$111
  Bottom 0.813: 71.12,54.61 71.12,54.29 | 71.12,57.47 71.12,54.61 | 71.12,54.61 71.75,54.61
N$112
  Bottom 0.813: 74.29,49.53 73.34,48.58
N$113
  Bottom 0.813: 133.99,48.89 133.99,54.93
N$114
  Bottom 0.813: 23.81,20.32 23.81,21.27
N$115
  Bottom 0.813: 67.95,20.32 67.95,21.27
N$116
  Bottom 0.813: 112.08,20.32 112.08,21.27
N$117
  Bottom 0.813: 101.28,36.51 101.28,30.48
N$118
  Bottom 0.813: 66.04,38.42 61.91,38.42
N$119
  Bottom 0.813: 57.15,36.51 57.15,30.48
N$120
  Bottom 0.813: 13.02,36.51 13.02,30.48
N$122  (via drill 0.61)
  other vias: 64.45,66.67
N$123  (via drill 0.61)
  other vias: 20,66.67
PE  (via drill 0.61)  (2 unrouted)
  Bottom 0.406: 104.78,67.63 105.41,68.26 105.41,67.94 104.78,67.31 105.73,68.26 | 42.55,15.56 42.23,15.56 42.23,16.19
  Bottom 0.813: R36.2 119.7,69.85 131.44,69.85 C15.2 | R38.2 R39.2 R38.2 | R50.2 R51.2 | R62.2 R63.2 | X2.4 9.63,4.66 10.79,3.49 | 19.68,4.76 19.68,6.35 X2.2 19.63,4.71 18.42,3.49 | R3.2 14.92,51.12 14.92,53.66 15.56,54.29 15.56,54.61 15.88,54.93 R2.2 10.48,57.15 9.53,58.1 IC3.GND 9.53,62.86 12.07,65.41 15.24,68.26 R12.2 30.8,69.85 42.55,69.85 C4.2 45.72,69.85 58.74,69.85 60.33,68.26 | 61.28,68.26 R24.2 75.25,69.85 87,69.85 C10.2 88.58,68.58 89.85,69.85 103.19,69.85 104.78,68.26 | R36.2 117.79,68.26 | 60.33,67.31 R14.2 R15.2 63.18,47.31 63.18,43.81 62.23,42.86 58.42,42.86 51.12,35.88 51.12,30.48 48.58,27.94 R62.2 | 61.28,68.26 60.33,68.26 | 61.28,68.26 60.33,67.31 | 60.33,68.26 60.33,67.31 | 104.78,68.26 104.78,67.63 104.78,67.31 R26.2 R27.2 107.32,47.62 107.32,43.81 106.36,42.86 103.5,42.86 95.25,35.56 95.25,30.16 93.34,28.26 R50.2 | 104.78,68.26 105.41,68.26 105.73,68.26 R36.2 | R50.2 86.36,16.51 | 86.36,16.51 87.31,15.56 | 86.36,15.56 85.41,15.56 | 87.31,15.56 86.36,15.56 | 87.31,15.56 100.96,15.56 C20.2 103.82,15.56 115.57,15.56 R48.2 v118.75,17.14 | 86.36,16.51 86.36,15.56 | 86.36,16.51 85.41,15.56 | 42.23,16.83 R62.2 | 43.18,15.56 56.83,15.56 58.1,16.83 C25.2 59.69,15.56 71.44,15.56 R60.2 74.61,15.56 85.41,15.56 | R72.2 27.31,15.56 15.56,15.56 C30.1 9.53,12.7 9.53,4.76 10.79,3.49 | 18.42,3.49 10.79,3.49 | 19.68,4.76 18.42,3.49 | 19.68,4.76 19.68,9.84 22.54,12.38 29.85,12.38 33.02,15.56 41.27,15.56 | 43.18,15.56 42.55,15.56 41.27,15.56 | 43.18,15.56 42.23,16.83 | 42.23,16.83 41.27,15.56 | v130.49,24.76 R38.2 | v127.32,17.14 v130.49,20.32
PE1
  Bottom 0.813: 88.58,68.26 87,69.85 75.25,69.85 73.66,68.26
PE2
  Bottom 0.813: 133.03,68.26 131.44,69.85 119.7,69.85 118.11,68.26
PE3
  Bottom 0.813: 102.24,17.14 103.82,15.56 115.57,15.56 117.16,17.14
PE4
  Bottom 0.813: 58.1,17.14 59.69,15.56 71.44,15.56 73.03,17.14
PE5
  Bottom 0.813: 13.97,17.14 15.56,15.56 27.31,15.56 28.89,17.14